# Altium schematic sheet 4.2inchdisplay1.SchDoc
size 381 x 341 mm; SheetNumber: 1; SheetTotal: 2
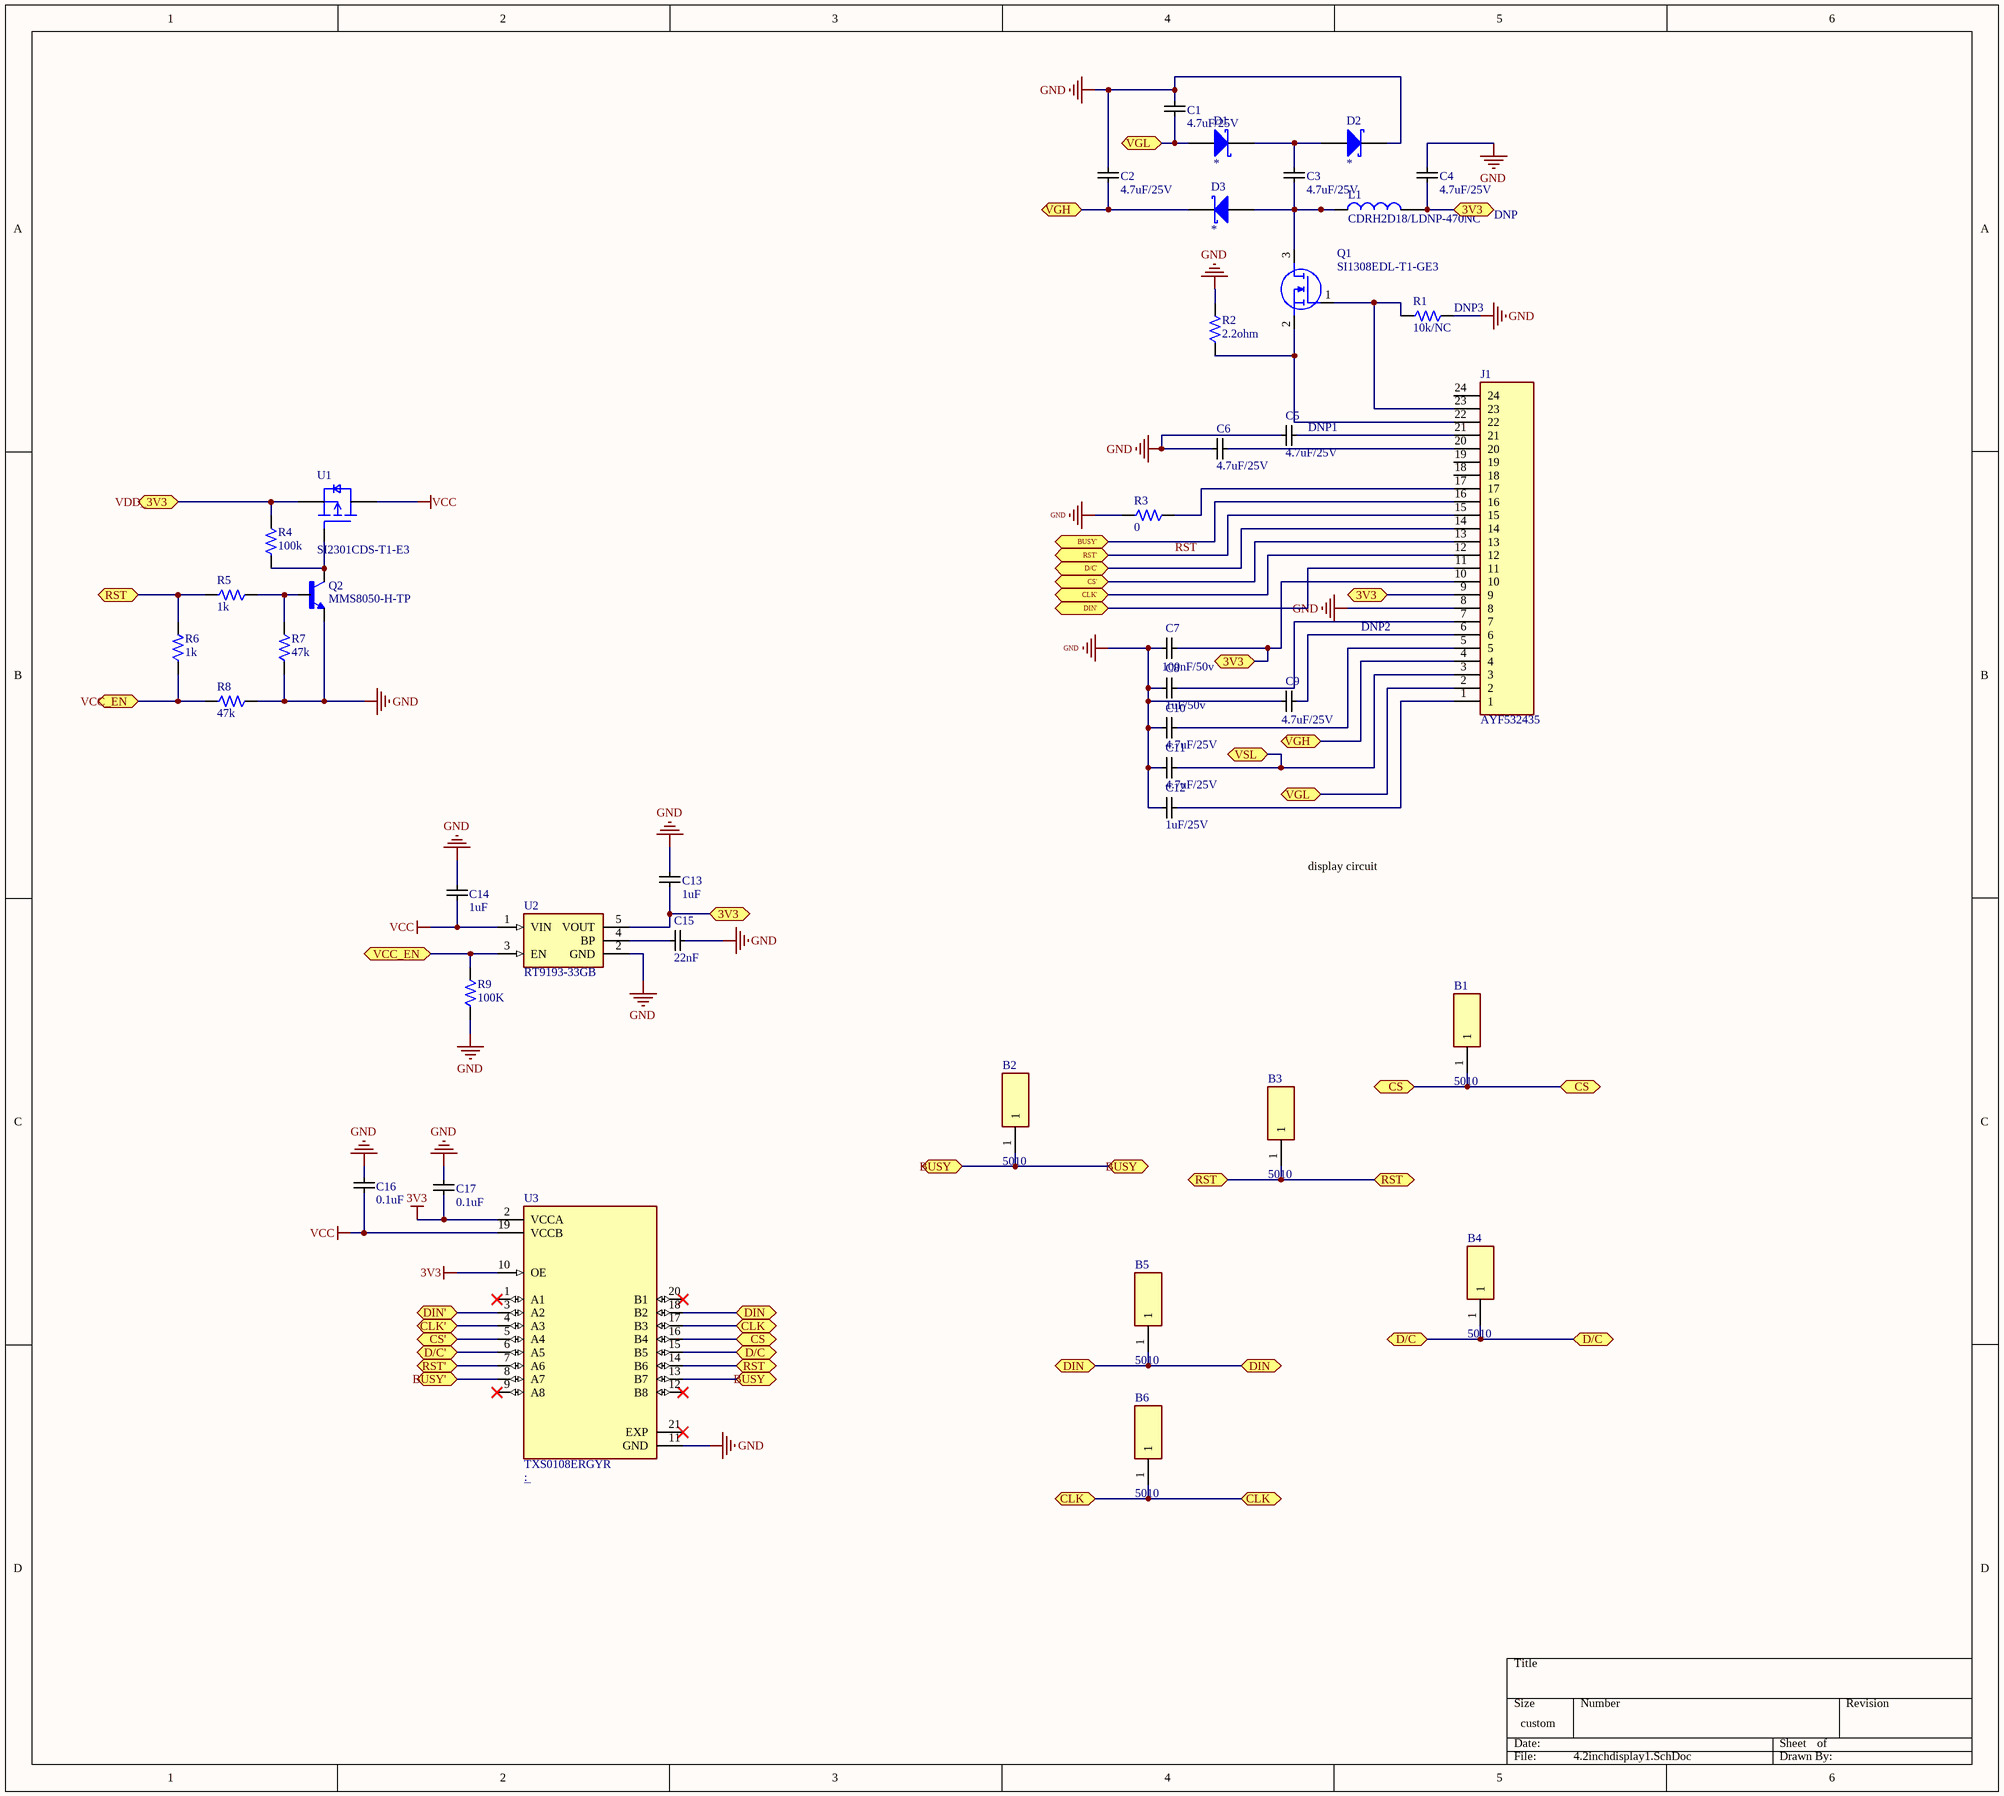
[diagram p0: 4.2inchdisplay1.SchDoc]

## Parts
B1  5010  [5010]
B2  5010  [5010]
B3  5010  [5010]
B4  5010  [5010]
B5  5010  [5010]
B6  5010  [5010]
C1  4.7uF/25V  [Cap_0805]
C2  4.7uF/25V  [Cap_0805]
C3  4.7uF/25V  [Cap_0805]
C4  4.7uF/25V  [Cap_0805]
C5  4.7uF/25V  [Cap_0805]
C6  4.7uF/25V  [Cap_0805]
C7  100nF/50v  [Cap_0603]
C8  1uF/50v  [Cap_0603]
C9  4.7uF/25V  [Cap_0805]
C10  4.7uF/25V  [Cap_0805]
C11  4.7uF/25V  [Cap_0805]
C12  1uF/25V  [Cap_0805]
C13  1uF  [Cap_0603]
C14  1uF  [Cap_0603]
C15  22nF  [Cap_0603]
C16  0.1uF  [Cap_0603]
C17  0.1uF  [Cap_0603]
D1  *  [ON_Semi_SOD-123F_0]
D2  *  [ON_Semi_SOD-123F_0]
D3  *  [ON_Semi_SOD-123F_0]
J1  AYF532435  [PANASONIC_AYF532435]
L1  CDRH2D18/LDNP-470NC  [IND_CDRH2D18/HPNP-1R1NC]
Q1  SI1308EDL-T1-GE3  [SOT65P210X110-3N]
Q2  MMS8050-H-TP  [SOT23-BEC]
R1  10k/NC  [RES_0805]
R2  2.2ohm  [RES_0805]
R3  0  [RES_0603]
R4  100k  [RES_0603]
R5  1k  [RES_0603]
R6  1k  [RES_0603]
R7  47k  [RES_0603]
R8  47k  [RES_0603]
R9  100K  [RES_0603]
U1  SI2301CDS-T1-E3  [SOT23-3]
U2  RT9193-33GB  [SOT94P279X129-5N]
U3  TXS0108ERGYR  [IC_TXS0108ERGYR]

## Ports
3V3 (bidir), BUSY (bidir), BUSY' (bidir), CLK (bidir), CLK' (bidir), CS (bidir), CS' (bidir), D/C (bidir), D/C' (bidir), DIN (bidir), DIN' (bidir), RST (bidir), RST' (bidir), VCC_EN (bidir), VDD_3V3 (bidir), VGH (bidir), VGL (bidir), VSL (bidir)

## Nets
3V3: C17.2 U3.2(VCCA) U3.10(OE)
GND: C1.2 C2.2 C4.2 C5.1 C6.1 C7.1 C8.1 C9.1 C10.1 C11.1 C12.1 C13.2 C14.2 C15.2 C16.2 C17.1 D2.1(K) J1.8 Q2.E R1.2 R2.2 R3.1 R7.1 R8.2 R9.1 U2.2(GND) U3.11(GND)
VCC: C14.1 C16.1 U1.3(D) U2.1(VIN) U3.19(VCCB)
3V3: C4.1 C7.2 C13.1 J1.9 J1.10 L1.2 U2.5(VOUT) ; port 3V3  [a separate net that carries the same name]
BUSY: B2.1 U3.13(B7) ; port BUSY
BUSY': J1.16 U3.8(A7) ; port BUSY'
CLK: B6.1 U3.17(B3) ; port CLK
CLK': J1.12 U3.4(A3) ; port CLK'
CS: B1.1 U3.16(B4) ; port CS
CS': J1.13 U3.5(A4) ; port CS'
D/C: B4.1 U3.15(B5) ; port D/C
D/C': J1.14 U3.6(A5) ; port D/C'
DIN: B5.1 U3.18(B2) ; port DIN
DIN': J1.11 U3.3(A2) ; port DIN'
RST: J1.15 U3.7(A6) ; port RST'
RST: B3.1 R5.1 R6.2 U3.14(B6) ; port RST  [a separate net that carries the same name]
VCC_EN: R6.1 R8.1 R9.2 U2.3(EN) ; port VCC_EN
VDD_3V3: R4.2 U1.2(S) ; port VDD_3V3
VGH: C2.1 D3.1(K) J1.4 ; port VGH
VGL: C1.1 D1.2(A) J1.2 ; port VGL
VSL: C11.2 J1.3 ; port VSL
NetC3_1: C3.1 D3.2(A) L1.1 Q1.3(D)
NetC3_2: C3.2 D1.1(K) D2.2(A)
NetC5_2: C5.2 J1.21
NetC6_2: C6.2 J1.20
NetC8_2: C8.2 J1.7
NetC9_2: C9.2 J1.6
NetC10_2: C10.2 J1.5
NetC12_2: C12.2 J1.1
NetC15_1: C15.1 U2.4(BP)
NetJ1_17: J1.17 R3.2
NetJ1_22: J1.22 Q1.2(S) R2.1
NetJ1_23: J1.23 Q1.1(G) R1.1
NetQ2_B: Q2.B R5.2 R7.2
NetQ2_C: Q2.C R4.1 U1.1(G)

Not connected (* = marked no-connect by the designer): J1 18 19 24; U3 1(A1)* 9(A8)* 12(B8)* 20(B1)* 21(EXP)*

## Notes on the sheet
- DNP
- (near R1) DNP3
- (near C5) DNP1
- DNP2
- display circuit

## Library data of the parts
B1-B6 = 5010: KEYSTONE - 5010 - TEST POINT, PCB, THROUGH HOLE; Manufacturer_Name: Keystone Electronics; Geometry.Height: 8.28mm; Manufacturer_Part_Number: 5010; Mouser Part Number: 534-5010; Mouser Price/Stock: https://www.mouser.co.uk/ProductDetail/Keystone-Electronics/5010?qs=qOqV1E1P08SzD%252BWfk1wMXQ%3D%3D; Arrow Part Number: 5010; Arrow Price/Stock: https://www.arrow.com/en/products/5010/keystone-electronics?region=europe; Datasheet Link: http://www.farnell.com/datasheets/1703983.pdf; MP: 5010
C1-C6 = CAP_0805: MP: KAM15AR71H104KM; Voltage Rating: *; Tolerance: *; Package Size: CAP_0805; Capacitance: *
  C5 C6: Parameter 1: *
C7 = CAP_0603: KAM15AR71H104KM; Voltage Rating: *; Tolerance: *; Package Size: CAP_0603; MP: KAM15AR71H104KM; Parameter 1: *
C8 = CAP_0603: UMK107AB7105KA-T; Voltage Rating: *; Tolerance: *; Package Size: CAP_0603; MP: UMK107AB7105KA-T; Parameter 1: *
C9-C11 = CAP_0805: TMK212AB7475KG-T; Voltage Rating: *; Tolerance: *; Package Size: CAP_0805; Capacitance: *; MP: TMK212AB7475KG-T; Parameter 1: *
C12 = CAP_0805: MCAST21GSB7105MTNB25; Voltage Rating: *; Tolerance: *; Package Size: CAP_0805; Capacitance: *; MP: MCAST21GSB7105MTNB25; Parameter 1: *
C13 C14 = CAP_0603: GRT188R61H105KE13D; Voltage Rating: *; Tolerance: *; Package Size: CAP_0603; MP: GRT188R61H105KE13D
C15 = CAP_0603: GCM188R71H223KA37J; Voltage Rating: *; Tolerance: *; Package Size: CAP_0603; MP: GCM188R71H223KA37J
C16 = CAP_0603: MP: GCM188R71H104KA57J; Voltage Rating: *; Tolerance: *; Package Size: CAP_0603
C17 = CAP_0603: GCM188R71H104KA57J; Voltage Rating: *; Tolerance: *; Package Size: CAP_0603; MP: GCM188R71H104KA57J
D1-D3 = Schottky Diode: Schottky Barrier Rectifier, 40 V Maximum DC Blocking Voltage, -65 to 125 degC, 2-Pin SMA Case, RoHS; MF: CDRH2D18/LDNP-470NC; ComponentLink1Description: Manufacturer URL; ComponentLink2Description: Datasheet; ComponentLink3URL: http://www.vishay.com/docs/88746/ss12.pdf; ComponentLink3Description: Package Specification; ComponentLink1URL: http://www.vishay.com/; ComponentLink2URL: http://www.vishay.com/docs/88746/ss12.pdf; MP: CDRH2D18/LDNP-470NC; Value: *; Parameter 1: *
J1 = AYF532435: 24 Position FFC, FPC Connector Contacts, Top and Bottom 0.020 (0.50mm) Surface Mount, Right Angle; MF: Panasonic Electric Works; Availability: In Stock; SnapEDA_Link: https://www.snapeda.com/parts/AYF532435/Panasonic/view-part/3222527/?ref=snap; MP: AYF532435; Value: *; Price: None; Package: None; Check_prices: https://www.snapeda.com/parts/AYF532435/Panasonic/view-part/3222527/?ref=eda; Purchase-URL: https://pricing.snapeda.com/search/part/AYF532435/?ref=eda; Parameter 1: *
L1 = CDRH2D18/HPNP-1R1NC: Power Inductors - SMD 47uH 0.48A 530ohms; MF: CDRH2D18/LDNP-470NC; Package: None; Price: None; Value: *; MP: CDRH2D18/LDNP-470NC; Availability: Unavailable; Parameter 1: *
Q1 = SI1308EDL-T1-GE3: N-Channel 30V 1.4A (Tc) 400mW (Ta), 500mW (Tc) Surface Mount SC-70-3; MF: Vishay Siliconix; MP: SI1308EDL-T1-GE3; Value: *; Check_prices: https://www.snapeda.com/parts/SI1308EDL-T1-GE3/Vishay%20Siliconix/view-part/5506696/?ref=eda; SnapEDA_Link: https://www.snapeda.com/parts/SI1308EDL-T1-GE3/Vishay%20Siliconix/view-part/5506696/?ref=snap; Price: None; Availability: In Stock; Purchase-URL: https://pricing.snapeda.com/search/part/SI1308EDL-T1-GE3/?ref=eda; Package: SOT-323 Vishay Semiconductor; Parameter 1: *
Q2 = MMBT2222*: Bipolar (BJT) Transistor NPN 30 V 600 mA 250MHz 300 mW Surface Mount SOT-23-3 (TO-236); MF: ON Semiconductor; Check_prices: https://www.snapeda.com/parts/MMBT2222/Onsemi/view-part/?ref=eda; Value: *; Availability: In Stock; MP: MMS8050-H-TP; Price: None; Package: SOT-23-3 Fairchild Semiconductor; SnapEDA_Link: https://www.snapeda.com/parts/MMBT2222/Onsemi/view-part/?ref=snap; Parameter 1: *
R1 = RES_0805: AC0603FR-0710KL; Power Rating: *; Tolerance: *; Package Size: RES_0805; MP: AC0603FR-0710KL; Parameter 1: *
R2 = RES_0805: CRCW08052R20FKEAHP; Power Rating: *; Tolerance: *; Package Size: RES_0805; MP: CRCW08052R20FKEAHP; Parameter 1: *
R3 = RES_0603: AC0603FR-070RL; Power Rating: *; Tolerance: *; Package Size: *; MP: AC0603FR-070RL; Parameter 1: *
R4 R9 = RES_0603: AC0603FR-07100KL; Power Rating: *; Tolerance: *; Package Size: *; MP: AC0603FR-07100KL
R5 R6 = RES_0603: AC0603FR-071KL; Power Rating: *; Tolerance: *; Package Size: *; MP: AC0603FR-071KL
R7 = RES_0603: RC0603FR-0747KL; Power Rating: *; Tolerance: *; Package Size: *; MP: RC0603FR-0747KL
R8 = RES_0603: MP: RC0603FR-0747KL; Power Rating: *; Tolerance: *; Package Size: *
U1 = AO3401: P-Channel 30 V 4A (Ta) 1.4W (Ta) Surface Mount SOT-23-3; MF: Alpha &; SnapEDA_Link: https://www.snapeda.com/parts/AO3401/Alpha+%2526+Omega+Semiconductor+Inc./view-part/?ref=snap; Package: TO-236-3 Alpha &amp; Omega Semiconductor Inc.; Value: *; MP: SI2301CDS-T1-E3; Check_prices: https://www.snapeda.com/parts/AO3401/Alpha+%2526+Omega+Semiconductor+Inc./view-part/?ref=eda; Parameter 1: *
U2 = RT9193-33GB: Linear Voltage Regulator IC Positive Fixed 1 Output 300mA TSOT-23-5; MF: Richtek USA; SnapEDA_Link: https://www.snapeda.com/parts/RT9193-33GB/Richtek+USA+Inc./view-part/?ref=snap; Package: SOT-23-5 Richtek; MP: RT9193-33GB; Check_prices: https://www.snapeda.com/parts/RT9193-33GB/Richtek+USA+Inc./view-part/?ref=eda; Purchase-URL: https://pricing.snapeda.com/search/part/RT9193-33GB/?ref=eda; Digi-Key_Part_Number: 1028-1014-2-ND; Value: *; Parameter 1: *
U3 = TXS0108ERGYR: 8-bit bidirectional voltage-level shifter for open-drain and push-pull application 20-VQFN -40 to 85; MF: Texas Instruments; Package: VQFN-20 Texas Instruments; Availability: Unavailable; MP: TXS0108ERGYR; SnapEDA_Link: https://www.snapeda.com/parts/TXS0108ERGYR/Texas%20Instruments/view-part/46552/?ref=snap; Purchase-URL: https://pricing.snapeda.com/search/part/TXS0108ERGYR/?ref=eda; Value: *; Price: None; Parameter 1: *